# EasyEDA Pro project OPA4377电磁运放_V1.0.eprj

# Schematic OPA4377电磁运放
Create Date: 2023-04-11; Page Name: P1; Project Name: OPA4377电磁运放_V1.0; Schematic Name: OPA4377电磁运放; Update Date: 2023-04-12; Company: 嘉立创EDA; Page Size: A4; Version: V1.0
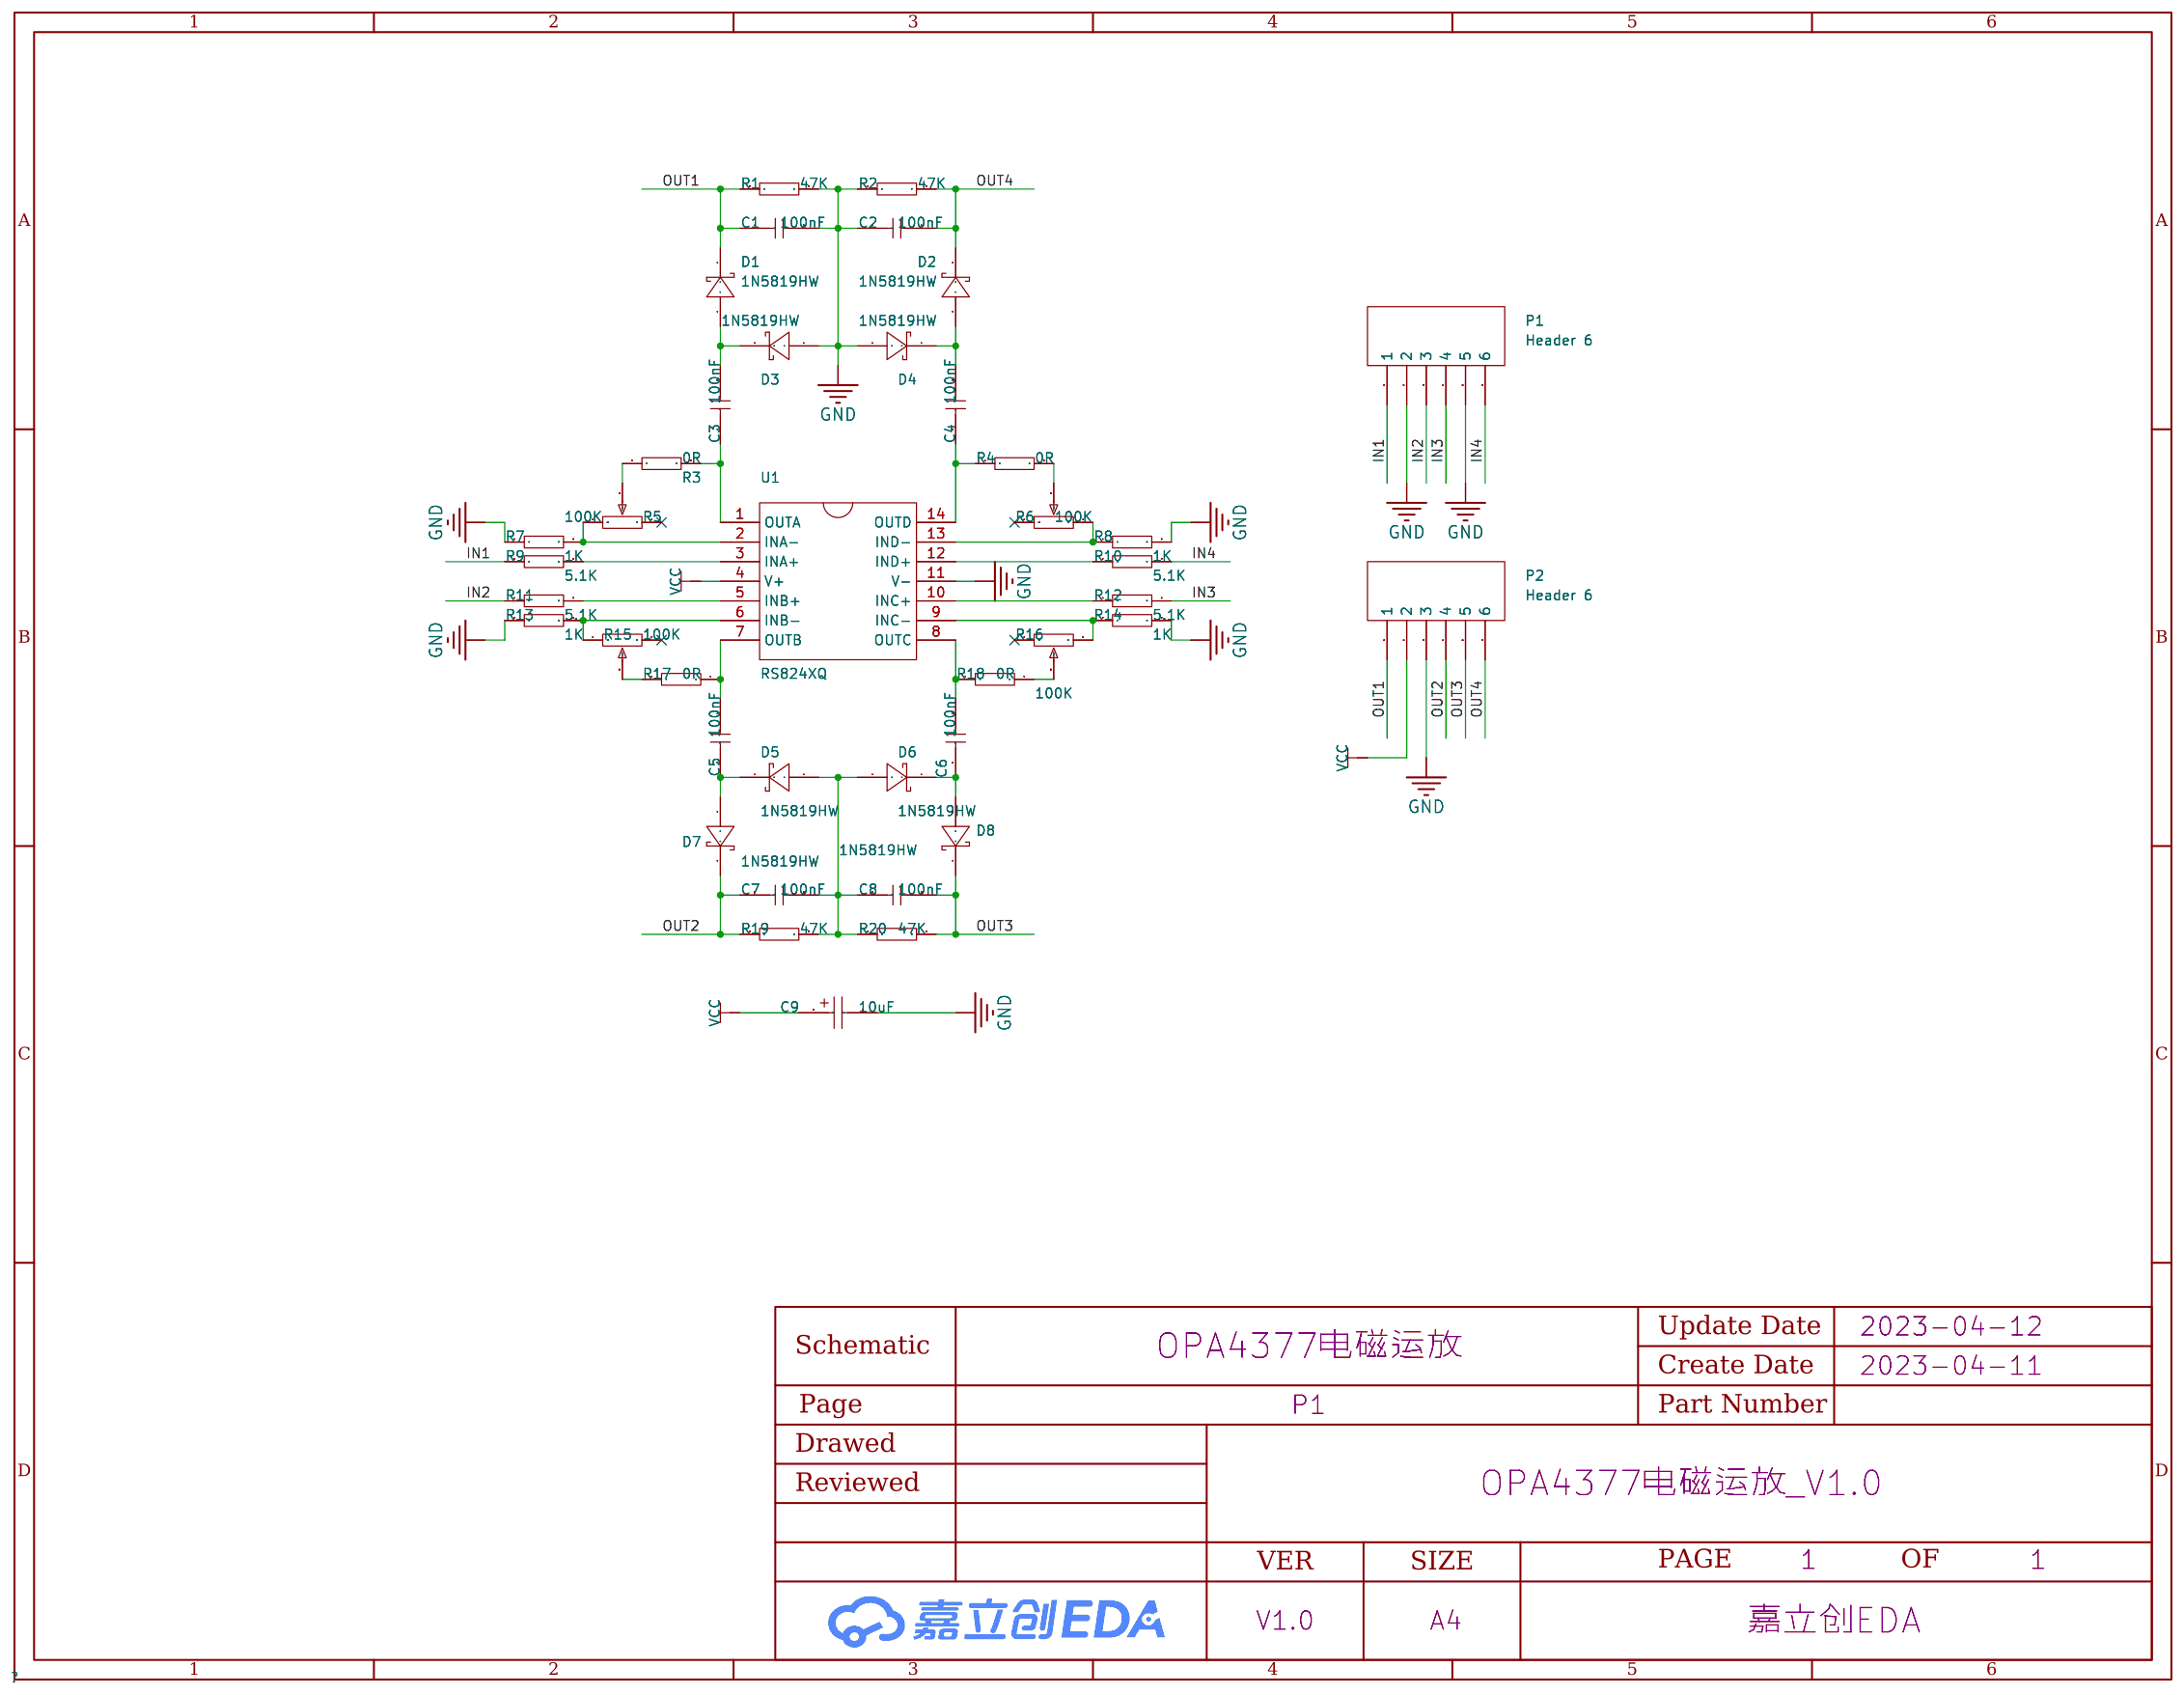
[diagram p0: schematic sheet]

## Parts
C1  100nF  [CAPC1608[0603]S-L]
C2  100nF  [CAPC1608[0603]S-L]
C3  100nF  [CAPC1608[0603]S-L]
C4  100nF  [CAPC1608[0603]S-L]
C5  100nF  [CAPC1608[0603]S-L]
C6  100nF  [CAPC1608[0603]S-L]
C7  100nF  [CAPC1608[0603]S-L]
C8  100nF  [CAPC1608[0603]S-L]
C9  10uF  [CAPT3216]
D1  1N5819HW  [SOD-123-L]
D2  1N5819HW  [SOD-123-L]
D3  1N5819HW  [SOD-123-L]
D4  1N5819HW  [SOD-123-L]
D5  1N5819HW  [SOD-123-L]
D6  1N5819HW  [SOD-123-L]
D7  1N5819HW  [SOD-123-L]
D8  1N5819HW  [SOD-123-L]
P1  Header 6  [HDR1X6]
P2  Header 6  [HDR1X6]
R1  47K  [RESC1608[0603]S-L]
R2  47K  [RESC1608[0603]S-L]
R3  0R  [RESC1608[0603]S-L]
R4  0R  [RESC1608[0603]S-L]
R5  100K  [RESPOT3296W]
R6  100K  [RESPOT3296W]
R7  1K  [RESC1608[0603]S-L]
R8  1K  [RESC1608[0603]S-L]
R9  5.1K  [RESC1608[0603]S-L]
R10  5.1K  [RESC1608[0603]S-L]
R11  5.1K  [RESC1608[0603]S-L]
R12  5.1K  [RESC1608[0603]S-L]
R13  1K  [RESC1608[0603]S-L]
R14  1K  [RESC1608[0603]S-L]
R15  100K  [RESPOT3296W]
R16  100K  [RESPOT3296W]
R17  0R  [RESC1608[0603]S-L]
R18  0R  [RESC1608[0603]S-L]
R19  47K  [RESC1608[0603]S-L]
R20  47K  [RESC1608[0603]S-L]
U1  RS824XQ  [TSSOP-14]

## Library data of the parts
C1-C8 = 100nF 0603 50V X7R: Revision: V1.0; Voltage: 50V; Type: X7R; Origin Footprint 2: CAPC1608[0603]-L; Origin Footprint 3: CAPC1608[0603]-M; Origin Footprint 4: CAPC1608[0603]-N; Origin Footprint 5: CAPC1608[0603]S-M; Origin Footprint 6: CAPC1608[0603]S-N
C9 = 10uF 3216 16V: Revision: July-2002: Re-released for DXP Platform.; Type: TanCap; Voltage: 16V
D1-D8 = 1N5819HW: Revision: V1.0; Origin Footprint 2: SOD-323
P1 P2 = Header 6: LatestRevisionDate: 17-Jul-2002; LatestRevisionNote: Re-released for DXP Platform.; Publisher: Altium Limited; Price(RMB): 0.00; Origin Footprint 2: VH3.96-6; Origin Footprint 3: GH1.25T-6P
R1 R2 R19 R20 = Res-Chip_3: Revision: V1.0; Power: 1/8W; Tolerance: ±1%; Origin Footprint 2: RESC0603[0201]-L; Origin Footprint 3: RESC0603[0201]-M; Origin Footprint 4: RESC0603[0201]-N; Origin Footprint 5: RESC0603[0201]S-L; Origin Footprint 6: RESC0603[0201]S-M; Origin Footprint 7: RESC0603[0201]S-N; Origin Footprint 8: RESC1005[0402]-L; Origin Footprint 9: RESC1005[0402]S-M; Origin Footprint 10: RESC1005[0402]-M; Origin Footprint 11: RESC1005[0402]-N; Origin Footprint 12: RESC1005[0402]S-L; Origin Footprint 13: RESC1005[0402]S-N; Origin Footprint 14: RESC1608[0603]-L; Origin Footprint 15: RESC1608[0603]-M; Origin Footprint 16: RESC1608[0603]-N; Origin Footprint 17: RESC1608[0603]S-M; Origin Footprint 18: RESC1608[0603]S-N; Origin Footprint 19: RESC2012[0805]; Origin Footprint 20: RESC2012[0805]S-L; Origin Footprint 21: RESC2012[0805]S-M; Origin Footprint 22: RESC2012[0805]S-N; Origin Footprint 23: RESC3216[1206]; Origin Footprint 24: RESC3216[1206]S-L; Origin Footprint 25: RESC3216[1206]S-M; Origin Footprint 26: RESC3216[1206]S-N; Origin Footprint 27: RESC3225[1210]; Origin Footprint 28: RESC3225[1210]S; Origin Footprint 29: RESC5025[2010]; Origin Footprint 30: RESC5025[2010]S; Origin Footprint 31: RESC6332[2512]; Origin Footprint 32: RESC6332[2512]S
R3 R4 R17 R18 = Res-Chip: Revision: V1.0; Power: 1/8W; Tolerance: ±1%; Origin Footprint 2: RESC0603[0201]-L; Origin Footprint 3: RESC0603[0201]-M; Origin Footprint 4: RESC0603[0201]-N; Origin Footprint 5: RESC0603[0201]S-L; Origin Footprint 6: RESC0603[0201]S-M; Origin Footprint 7: RESC0603[0201]S-N; Origin Footprint 8: RESC1005[0402]-L; Origin Footprint 9: RESC1005[0402]S-M; Origin Footprint 10: RESC1005[0402]-M; Origin Footprint 11: RESC1005[0402]-N; Origin Footprint 12: RESC1005[0402]S-L; Origin Footprint 13: RESC1005[0402]S-N; Origin Footprint 14: RESC1608[0603]-L; Origin Footprint 15: RESC1608[0603]-M; Origin Footprint 16: RESC1608[0603]-N; Origin Footprint 17: RESC1608[0603]S-M; Origin Footprint 18: RESC1608[0603]S-N; Origin Footprint 19: RESC2012[0805]; Origin Footprint 20: RESC2012[0805]S-L; Origin Footprint 21: RESC2012[0805]S-M; Origin Footprint 22: RESC2012[0805]S-N; Origin Footprint 23: RESC3216[1206]; Origin Footprint 24: RESC3216[1206]S-L; Origin Footprint 25: RESC3216[1206]S-M; Origin Footprint 26: RESC3216[1206]S-N; Origin Footprint 27: RESC3225[1210]; Origin Footprint 28: RESC3225[1210]S; Origin Footprint 29: RESC5025[2010]; Origin Footprint 30: RESC5025[2010]S; Origin Footprint 31: RESC6332[2512]; Origin Footprint 32: RESC6332[2512]S
R5 R6 R15 R16 = Res-Adj-3p: Revision: V1.0; Origin Footprint 2: EVM3-3x3ADJ; Origin Footprint 3: RESPOT3296X; Origin Footprint 4: RESPOT3362; Origin Footprint 5: RESPOT3386P
R7 R8 R13 R14 = Res-Chip_1: Revision: V1.0; Power: 1/8W; Tolerance: ±1%; Origin Footprint 2: RESC0603[0201]-L; Origin Footprint 3: RESC0603[0201]-M; Origin Footprint 4: RESC0603[0201]-N; Origin Footprint 5: RESC0603[0201]S-L; Origin Footprint 6: RESC0603[0201]S-M; Origin Footprint 7: RESC0603[0201]S-N; Origin Footprint 8: RESC1005[0402]-L; Origin Footprint 9: RESC1005[0402]S-M; Origin Footprint 10: RESC1005[0402]-M; Origin Footprint 11: RESC1005[0402]-N; Origin Footprint 12: RESC1005[0402]S-L; Origin Footprint 13: RESC1005[0402]S-N; Origin Footprint 14: RESC1608[0603]-L; Origin Footprint 15: RESC1608[0603]-M; Origin Footprint 16: RESC1608[0603]-N; Origin Footprint 17: RESC1608[0603]S-M; Origin Footprint 18: RESC1608[0603]S-N; Origin Footprint 19: RESC2012[0805]; Origin Footprint 20: RESC2012[0805]S-L; Origin Footprint 21: RESC2012[0805]S-M; Origin Footprint 22: RESC2012[0805]S-N; Origin Footprint 23: RESC3216[1206]; Origin Footprint 24: RESC3216[1206]S-L; Origin Footprint 25: RESC3216[1206]S-M; Origin Footprint 26: RESC3216[1206]S-N; Origin Footprint 27: RESC3225[1210]; Origin Footprint 28: RESC3225[1210]S; Origin Footprint 29: RESC5025[2010]; Origin Footprint 30: RESC5025[2010]S; Origin Footprint 31: RESC6332[2512]; Origin Footprint 32: RESC6332[2512]S
R9-R12 = Res-Chip_2: Revision: V1.0; Power: 1/8W; Tolerance: ±1%; Origin Footprint 2: RESC0603[0201]-L; Origin Footprint 3: RESC0603[0201]-M; Origin Footprint 4: RESC0603[0201]-N; Origin Footprint 5: RESC0603[0201]S-L; Origin Footprint 6: RESC0603[0201]S-M; Origin Footprint 7: RESC0603[0201]S-N; Origin Footprint 8: RESC1005[0402]-L; Origin Footprint 9: RESC1005[0402]S-M; Origin Footprint 10: RESC1005[0402]-M; Origin Footprint 11: RESC1005[0402]-N; Origin Footprint 12: RESC1005[0402]S-L; Origin Footprint 13: RESC1005[0402]S-N; Origin Footprint 14: RESC1608[0603]-L; Origin Footprint 15: RESC1608[0603]-M; Origin Footprint 16: RESC1608[0603]-N; Origin Footprint 17: RESC1608[0603]S-M; Origin Footprint 18: RESC1608[0603]S-N; Origin Footprint 19: RESC2012[0805]; Origin Footprint 20: RESC2012[0805]S-L; Origin Footprint 21: RESC2012[0805]S-M; Origin Footprint 22: RESC2012[0805]S-N; Origin Footprint 23: RESC3216[1206]; Origin Footprint 24: RESC3216[1206]S-L; Origin Footprint 25: RESC3216[1206]S-M; Origin Footprint 26: RESC3216[1206]S-N; Origin Footprint 27: RESC3225[1210]; Origin Footprint 28: RESC3225[1210]S; Origin Footprint 29: RESC5025[2010]; Origin Footprint 30: RESC5025[2010]S; Origin Footprint 31: RESC6332[2512]; Origin Footprint 32: RESC6332[2512]S
U1 = RS824XQ

## Nets
GND: C1.2 C2.1 C9.2 D3.A D4.A P1.2 P1.5 P2.3 R1.2 R2.1 R7.1 R8.2 R13.1 R14.2 U1.11(V-)
VCC: C9.1 P2.2 U1.4(V+)
IN1: P1.1 R9.1
IN2: P1.3 R11.1
IN3: P1.4 R12.2
IN4: P1.6 R10.2
OUT1: C1.1 D1.K P2.1 R1.1
OUT2: C7.1 D7.K P2.4 R19.1
OUT3: C8.2 D8.K P2.5 R20.2
OUT4: C2.2 D2.K P2.6 R2.2
$1N567: R9.2 U1.3(INA+)
$1N745: R11.2 U1.5(INB+)
$1N933: C5.1 R17.2 U1.7(OUTB)
$1N1095: R15.ADJ R17.1
$1N1098: R13.2 R15.1(TOP) U1.6(INB-)
$1N1101: C5.2 D5.K D7.A
$1N1276: C6.2 R18.1 U1.8(OUTC)
$1N1280: C6.1 D6.K D8.A
$1N1560: C7.2 C8.1 D5.A D6.A R19.2 R20.1
$1N1836: R4.2 R6.ADJ
$1N1944: R6.1(TOP) R8.1 U1.13(IND-)
$1N1968: R10.1 U1.12(IND+)
$1N2079: R12.1 U1.10(INC+)
$1N2458: R16.ADJ R18.2
$1N2511: R14.1 R16.2(BOT) U1.9(INC-)
$1N2605: C3.1 R3.2 U1.1(OUTA)
$1N2608: C4.1 R4.1 U1.14(OUTD)
$1N2813: C4.2 D2.A D4.K
$1N2816: C3.2 D1.A D3.K
$1N5618: R3.1 R5.ADJ
$1N5619: R5.2(BOT) R7.2 U1.2(INA-)

Not connected (* = marked no-connect by the designer): R5 1(TOP)*; R6 2(BOT)*; R15 2(BOT)*; R16 1(TOP)*

# Board OPA4377电磁运放
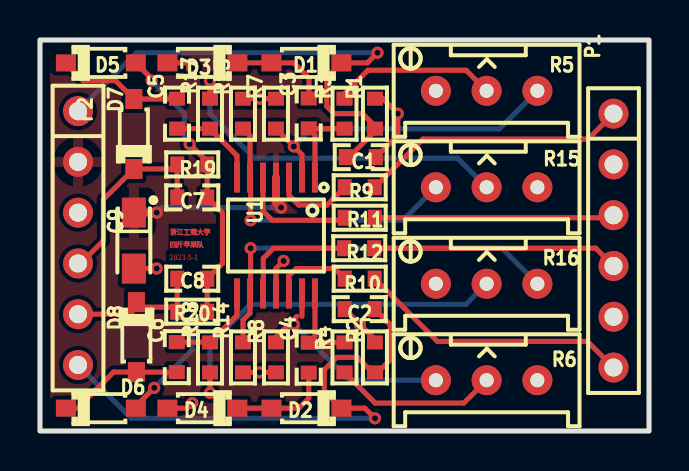
[diagram p1: board, top side]
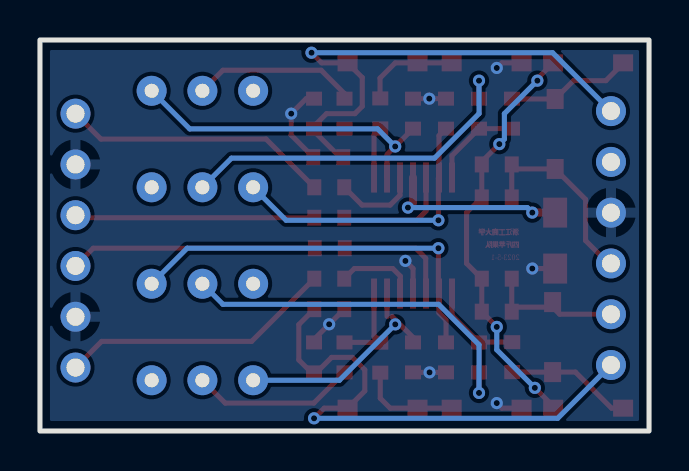
[diagram p2: board, bottom side, seen from below]

Outline 30.48 x 19.56 mm; copper layers: Top Layer, Bottom Layer. Coordinates in mm from the lower left corner of the outline.
Outline path: rectangle 0,19.56 30.48,0
Stack: Top Layer 0.035mm / Dielectric1 1.51mm FR4 er 4.5 / Bottom Layer 0.035mm

## Design rules (mm)
template: JLCPCB Capability(Two Layers Board)
spacing copperThickness1oz (default): track to track 0.102, other pairs 0.152 to 0.3
spacing copperThickness2oz: track to track 0.203, other pairs 0.152 to 0.3
track width copperThickness1oz (default): min 0.127, default 0.254, max 2.54
track width copperThickness2oz: min 0.203, default 0.254, max 2.54
differential pair differentialPair (default): width min 0.127, default 0.254, max 2.54; gap min 0.152, default 0.152
via viaSize (default): diameter min 0.5, default 0.61, max 10; hole min 0.3, default 0.305, max 6.3

## Placement (name value [footprint] x y rotation side)
C1  100nF  [CAPC1608[0603]S-L]  16.05 13.7 0 top
C2  100nF  [CAPC1608[0603]S-L]  16 6.1 0 top
C3  100nF  [CAPC1608[0603]S-L]  13.45 15.89 90 top
C4  100nF  [CAPC1608[0603]S-L]  13.45 3.67 270 top
C5  100nF  [CAPC1608[0603]S-L]  6.86 15.88 90 top
C6  100nF  [CAPC1608[0603]S-L]  6.85 3.69 90 top
C7  100nF  [CAPC1608[0603]S-L]  7.62 11.68 0 top
C8  100nF  [CAPC1608[0603]S-L]  7.62 7.62 180 top
C9  10uF  [CAPT3216]  4.7 9.53 270 top
D1  1N5819HW  [SOD-123-L]  13.34 18.42 0 top
D2  1N5819HW  [SOD-123-L]  13.34 1.14 0 top
D3  1N5819HW  [SOD-123-L]  8.13 18.42 0 top
D4  1N5819HW  [SOD-123-L]  8.13 1.14 0 top
D5  1N5819HW  [SOD-123-L]  3.05 18.42 180 top
D6  1N5819HW  [SOD-123-L]  3.05 1.14 180 top
D7  1N5819HW  [SOD-123-L]  4.7 14.86 270 top
D8  1N5819HW  [SOD-123-L]  4.83 4.7 90 top
P1  Header 6  [HDR1X6]  28.7 15.88 270 top
P2  Header 6  [HDR1X6]  1.91 16 270 top
R1  47K  [RESC1608[0603]S-L]  16.76 15.88 90 top
R2  47K  [RESC1608[0603]S-L]  16.76 3.68 270 top
R3  0R  [RESC1608[0603]S-L]  15.24 15.88 270 top
R4  0R  [RESC1608[0603]S-L]  15.24 3.68 270 top
R5  100K  [RESPOT3296W]  22.35 17.02 0 top
R6  100K  [RESPOT3296W]  22.35 2.54 0 top
R7  1K  [RESC1608[0603]S-L]  11.81 15.88 270 top
R8  1K  [RESC1608[0603]S-L]  11.81 3.68 270 top
R9  5.1K  [RESC1608[0603]S-L]  16 12.19 180 top
R10  5.1K  [RESC1608[0603]S-L]  16 7.62 0 top
R11  5.1K  [RESC1608[0603]S-L]  16 10.67 180 top
R12  5.1K  [RESC1608[0603]S-L]  15.98 9.14 0 top
R13  1K  [RESC1608[0603]S-L]  10.16 15.88 270 top
R14  1K  [RESC1608[0603]S-L]  10.16 3.68 270 top
R15  100K  [RESPOT3296W]  22.35 12.19 0 top
R16  100K  [RESPOT3296W]  22.35 7.37 0 top
R17  0R  [RESC1608[0603]S-L]  8.51 15.88 270 top
R18  0R  [RESC1608[0603]S-L]  8.51 3.68 270 top
R19  47K  [RESC1608[0603]S-L]  7.62 13.33 0 top
R20  47K  [RESC1608[0603]S-L]  7.62 5.97 180 top
U1  RS824XQ  [TSSOP-14]  11.81 9.78 270 top

## Footprints (pads in the part's own frame, mm; a bottom-side part is the same pattern mirrored in y, then rotated)
CAPC1608[0603]S-L
  rect 0.7x0.8 smd: 1(-0.75,0) 2(0.75,0)
CAPT3216
  rect 1.5x1.2 smd: 1(-1.4,0) 2(1.4,0)
HDR1X6
  round 1.5 hole 0.9: 1(0,0) 2(2.54,0) 3(5.08,0) 4(7.62,0) 5(10.16,0) 6(12.7,0)
RESC1608[0603]S-L
  rect 0.7x0.8 smd: 1(-0.75,0) 2(0.75,0)
RESPOT3296W
  round 1.5 hole 0.7: 1(-2.54,0) 2(2.54,0) ADJ(0,0)
SOD-123-L
  rect 1x0.85 smd: A(-1.75,0) K(1.75,0)
TSSOP-14
  rect 1.5x0.3 smd: 1(-2.9,1.95) 2(-2.9,1.3) 3(-2.9,0.65) 4(-2.9,0) 5(-2.9,-0.65) 6(-2.9,-1.3) 7(-2.9,-1.95) 8(2.9,-1.95) 9(2.9,-1.3) 10(2.9,-0.65) 11(2.9,0) 12(2.9,0.65) 13(2.9,1.3) 14(2.9,1.95)

## Nets
As in the schematic.

Pads without a net: R5 1; R6 2; R15 2; R16 1

## Via types
v1: diameter 0.61, hole 0.305, Top Layer to Bottom Layer, 22 vias

## Routing (per net, layer and track width the routed paths; a pad name or vN(x,y) marks a point on that pad's centre or on a via; arc(x,y) is an arc through that point)
GND: length 15.3
  Top Layer w0.254: C1.2 17.91,14.8 v1(17.91,15.88) 17.16,16.62 R1.2 ; R7.1 v1(11,16.62) R13.1 ; v1(5.84,8.13) 4.7,8.13 C9.2 ; R2.1 16.76,4.58 v1(16.01,5.34) C2.1 ; v1(12.19,8.51) 11.81,8.13 11.81,6.88 ; v1(7.62,1.4) 7.37,1.14 D4.A ; v1(7.62,18.16) 7.37,18.42 D3.A ; R8.2 v1(10.99,2.93) R14.2
VCC: length 9.1
  Top Layer w0.4: v1(12.06,11.18) 11.81,11.43 U1.4 ; v1(5.84,10.92) 4.7,10.92
  Bottom Layer w0.254: v1(5.84,10.92) 6.09,11.18 v1(12.06,11.18)
IN1: length 13.5
  Top Layer w0.254: P1.1 27.43,14.61 19.16,14.61 R9.1
IN2: length 12
  Top Layer w0.254: P1.3 28.57,10.67 R11.1
IN3: length 12.3
  Top Layer w0.254: P1.4 27.81,9.14 R12.2
IN4: length 13.8
  Top Layer w0.254: P1.6 27.39,4.48 19.89,4.48 R10.2
OUT1: length 25.9
  Top Layer w0.254: C1.1 15.47,13.7 16.89,15.12 16.14,15.88 14.72,15.88 14.35,16.24 14.35,17.68 D1.K 16.38,18.42 v1(16.89,18.92)
  Bottom Layer w0.254: P2.1 4.83,18.92 v1(16.89,18.92)
OUT2: length 9.9
  Top Layer w0.254: C7.1 R19.1 6.64,13.11 D7.K 3.18,11.58 3.18,9.53 2.03,8.38 P2.4
OUT3: length 6.9
  Top Layer w0.254: C8.2 R20.2 6.64,6.19 4.83,6.19 4.47,5.84 P2.5
OUT4: length 27.1
  Top Layer w0.254: v1(16.76,0.64) 16.26,1.14 D2.K 14.22,2 14.22,3.06 14.85,3.68 15.89,3.68 16.64,2.93 R2.2 16.9,2.93 17.53,3.56 17.53,5.32 C2.2
  Bottom Layer w0.254: v1(16.76,0.64) 4.57,0.64 P2.6
$1N567: length 4.2
  Top Layer w0.254: R9.2 14.36,11.3 12.95,11.3 12.46,11.8 U1.3
$1N745: length 6
  Top Layer w0.254: R11.2 15.12,10.54 11.62,10.54 11.16,11 U1.5
$1N933: length 4.7
  Top Layer w0.254: 9.86,12.68 9.86,13.77 R17.2 C5.1
$1N1095: length 17.9
  Top Layer w0.254: v1(8.51,17.53) R17.1
  Bottom Layer w0.254: v1(8.51,17.53) 8.51,15.88 10.74,13.65 20.9,13.65 R15.ADJ
$1N1098: length 14.7
  Top Layer w0.254: R13.2 10.51,14.77 U1.6 10.54,12.65 v1(10.54,10.54)
  Bottom Layer w0.254: R15.1 18.16,10.54 v1(10.54,10.54)
$1N1101: length 6.3
  Top Layer w0.254: C5.2 6.84,16.61 D7.A 3.78,17.53 2.16,17.53 1.3,18.39 D5.K
$1N1276: length 4.7
  Top Layer w0.254: 9.86,6.88 9.86,5.78 R18.1 8.5,4.44 C6.2
$1N1280: length 6.3
  Top Layer w0.254: C6.1 4.83,2.94 D8.A 3.68,2.95 1.88,1.14 D6.K
$1N1560: length 21
  Top Layer w0.254: v1(7.62,5.21) 7.62,5.22 R20.1 C8.1 9.13,8.38 9.13,10.92 C7.2 R19.2 8.37,13.47 v1(7.49,14.35) ; D5.A 5.69,17.53 v1(5.59,17.53) ; v1(5.72,2.16) 4.8,1.24 D6.A
  Bottom Layer w0.254: v1(5.59,17.53) 7.24,15.88 7.24,14.61 v1(7.49,14.35) ; v1(5.72,2.16) 7.62,4.06 v1(7.62,5.21)
$1N1836: length 8.2
  Top Layer w0.254: R4.2 16.78,1.4 21.21,1.4 R6.ADJ
$1N1944: length 11.3
  Top Layer w0.254: 13.11,5.73 13.11,6.88 ; 11.56,4.43 12.86,5.73
  Bottom Layer w0.254: R6.1 15.49,2.54 v1(12.7,5.33)
$1N1968: length 4
  Top Layer w0.254: R10.1 14.74,8.13 12.83,8.13 12.45,7.75 12.45,6.89 12.46,6.88
$1N2079: length 5.9
  Top Layer w0.254: 11.18,6.98 11.18,8.64 11.68,9.14 R12.1
$1N2458: length 18.5
  Top Layer w0.254: v1(8.51,1.91) R18.2
  Bottom Layer w0.254: R16.ADJ 21.32,6.34 10.53,6.34 8.51,4.32 v1(8.51,1.91)
$1N2511: length 20
  Top Layer w0.254: v1(10.54,9.14) 10.54,6.91 10.51,6.88 10.51,5.9 10.16,5.55 R14.1
  Bottom Layer w0.254: v1(10.54,9.14) 23.11,9.14 R16.2
$1N2605: length 4.4
  Top Layer w0.254: C3.1 13.46,15.12 ; 13.46,15.12 R3.2 ; 13.46,15.12 13.76,14.83 U1.1
$1N2608: length 4.4
  Top Layer w0.254: 13.46,4.43 R4.1 ; 13.46,4.43 13.76,4.73 13.76,6.88 ; 13.46,4.43 C4.1
$1N2813: length 5.1
  Top Layer w0.254: D4.K D2.A 12.95,1.14 13.45,1.64 C4.2
$1N2816: length 4.9
  Top Layer w0.254: D3.K D1.A 12.7,18.42 13.46,17.65 13.46,16.65 C3.2
$1N5618: length 8.3
  Top Layer w0.254: R3.1 15.24,16.88 16.41,18.05 21.32,18.05 R5.ADJ
$1N5619: length 16.3
  Top Layer w0.254: R7.2 v1(12.7,14.23) 13.11,13.83 U1.2
  Bottom Layer w0.254: R5.2 22.99,15.11 13.58,15.11 v1(12.7,14.23)

## Copper pours and planes (outline as drawn; the poured copper is in the pictures)
GND on Bottom Layer: -4.57,22.48 37.34,22.48 37.34,-2.41 -4.57,-2.41
VCC on Top Layer: -2.29,21.34 33.02,21.34 33.02,-1.65 -2.29,-1.65

## Text on the board
Top Layer: 浙江工商大学 | 四斤苹果队 | 2023-5-1
